# EasyEDA schematic SCH_AP-Button-LED-V2_EasyEDA.json
TITLE: Sheet_1; REV: 1.0; Date: 2024-01-07; Sheet: 1/1; Drawn By: scottguiness; Company: Your Company
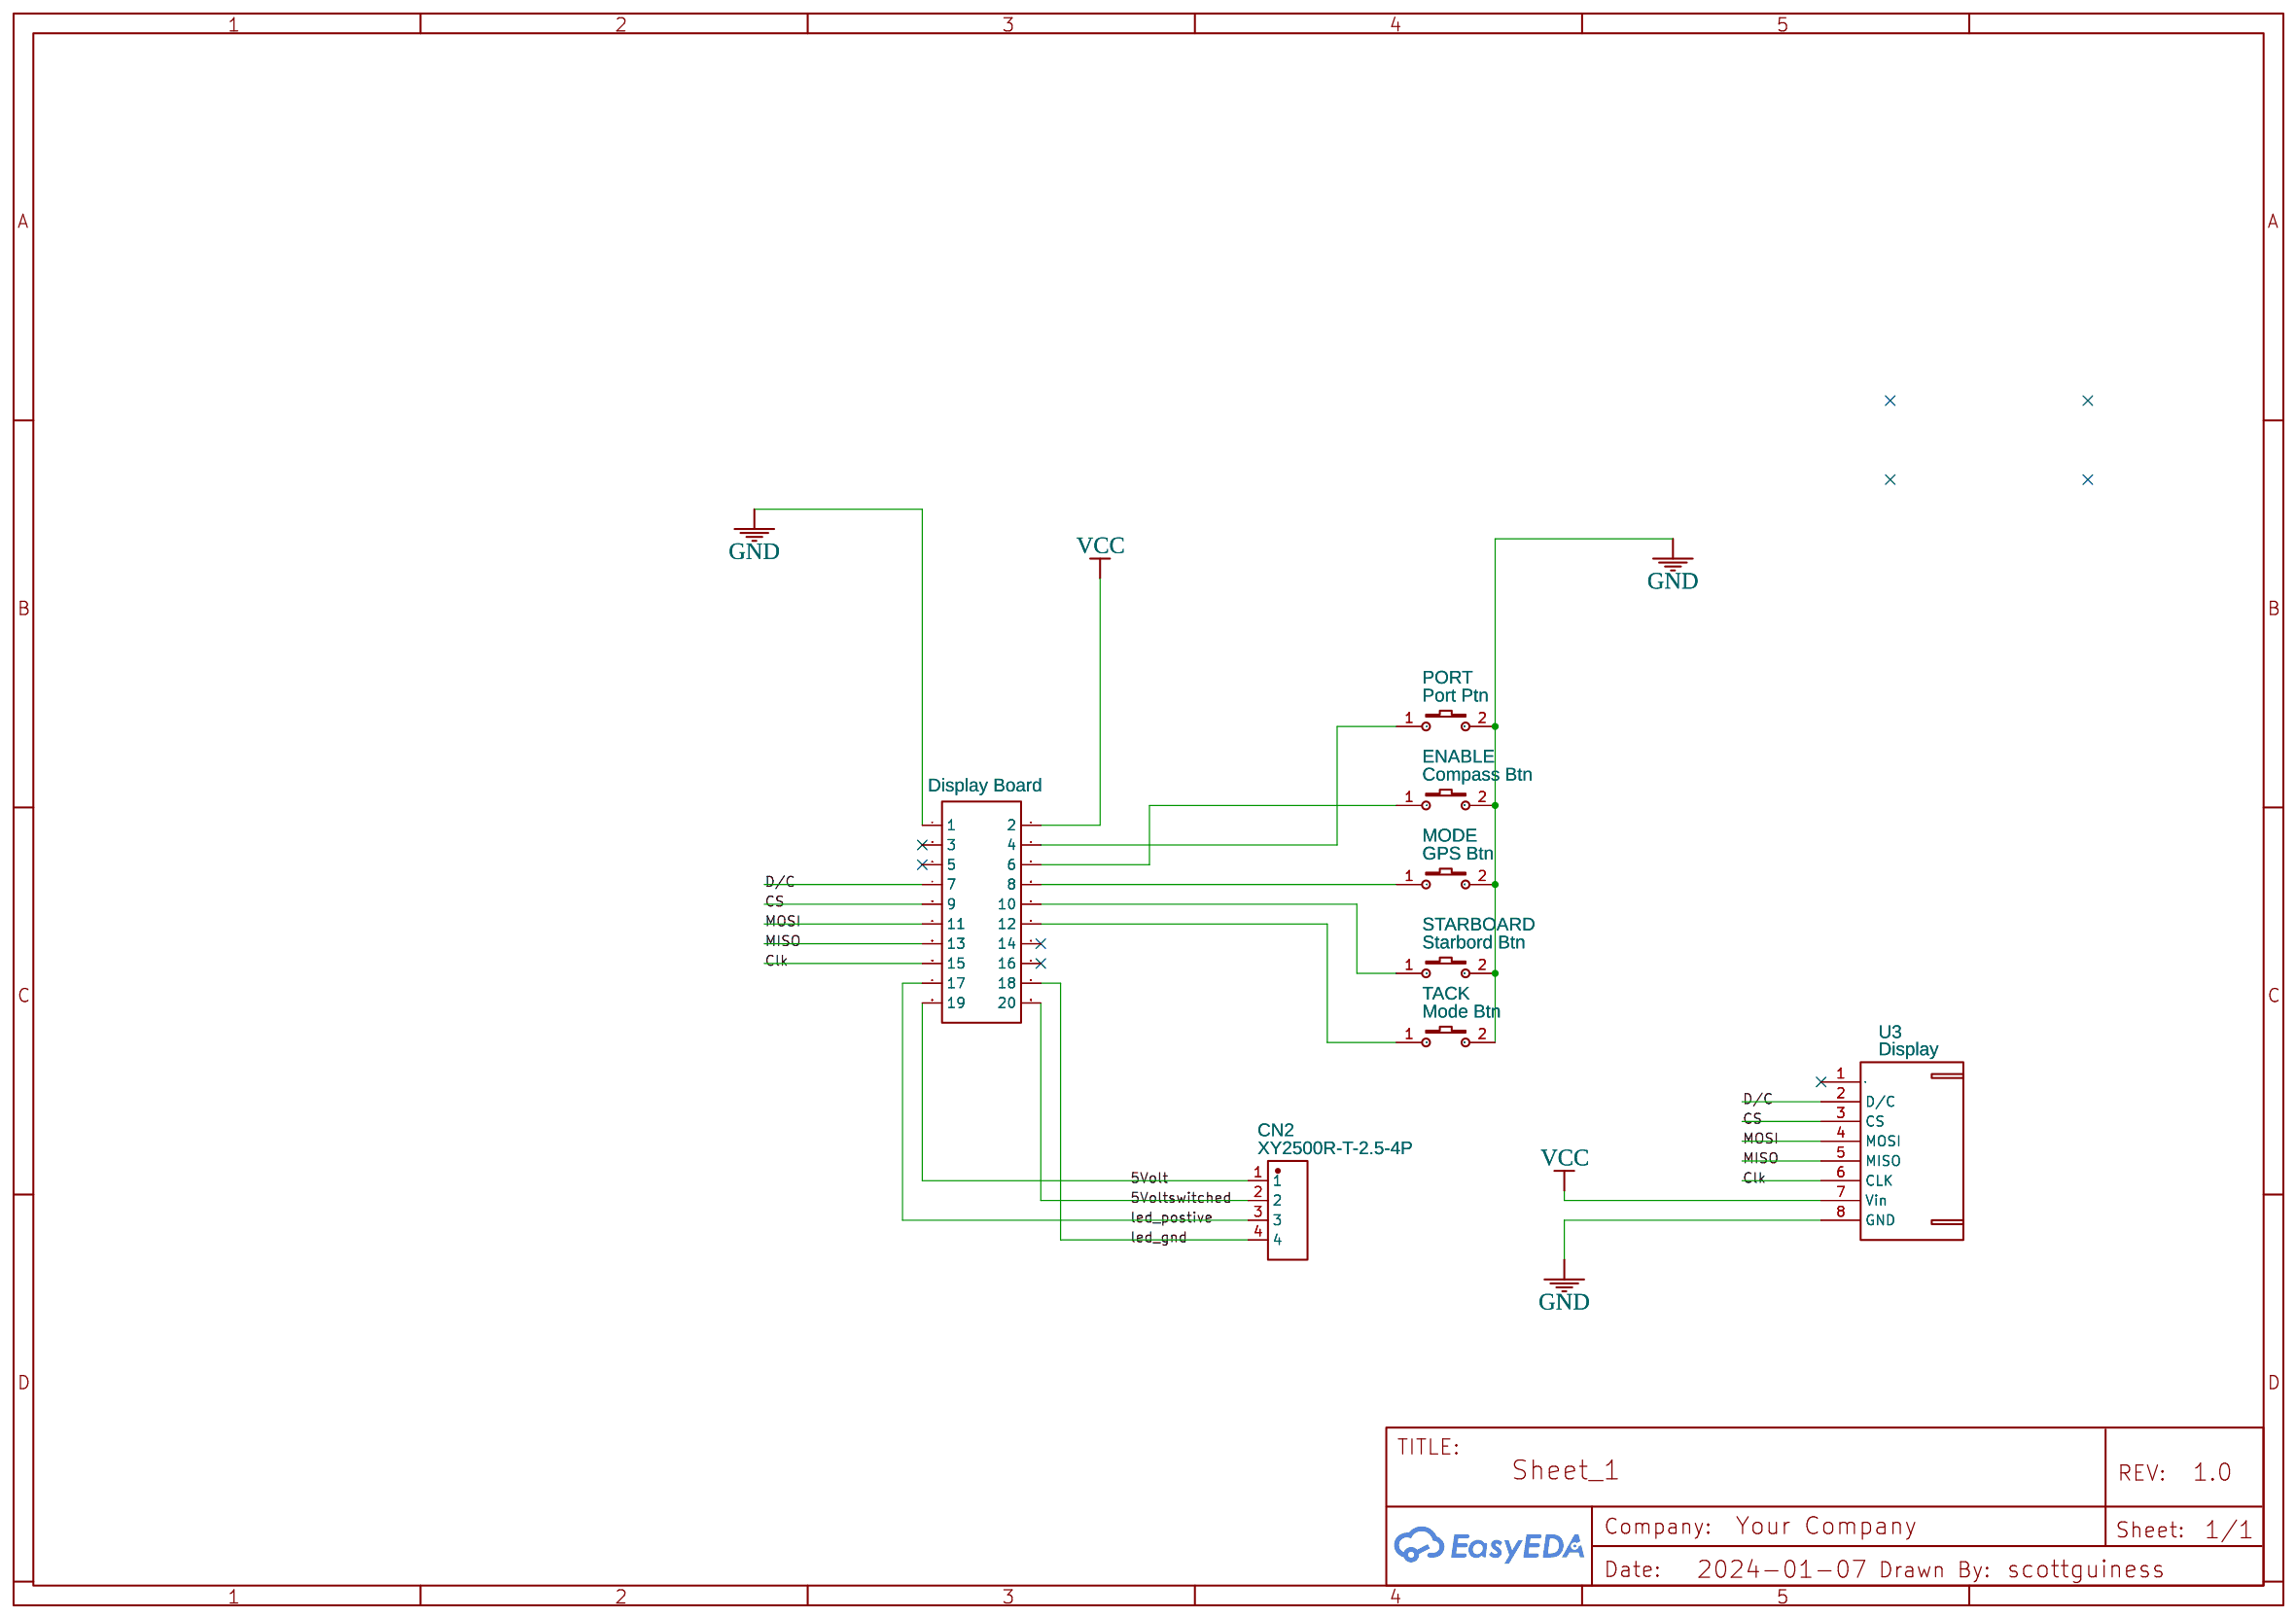
[diagram p0: schematic sheet]

## Parts
BUTTON_LED1  Display Board  [HDR-M-2.54_2X10]
CN2  XY2500R-T-2.5-4P  [CONN-TH_XY2500R-T-2.5-4P]
ENABLE  Compass Btn  [KEY-SMD_2P-L6.2-W3.6-LS8.0]
MODE  GPS Btn  [KEY-SMD_2P-L6.2-W3.6-LS8.0]
PORT  Port Ptn  [KEY-SMD_2P-L6.2-W3.6-LS8.0]
STARBOARD  Starbord Btn  [KEY-SMD_2P-L6.2-W3.6-LS8.0]
TACK  Mode Btn  [KEY-SMD_2P-L6.2-W3.6-LS8.0]
U3  Display  [JST-XH-8-PIN]

## Library data of the parts
BUTTON_LED1 = HDR-M-2.54_2x10: Supplier Part: C124359; Supplier: LCSC; Contributor: LCEDA_Lib
CN2 = XY2500R-T-2.5-4P: Contributor: LCSC; Supplier: LCSC; Supplier Part: C784963; Manufacturer: XINLAIYA(新莱亚); JLCPCB Part Class: Extended Part
ENABLE MODE PORT STARBOARD TACK = K2-3.6×6.1_SMD: Supplier Part: C118141; Supplier: LCSC; Manufacturer Part: K2-1107ST-A4SW-06; Contributor: LCEDA_Lib; 制造商: 韩国韩荣
U3 = JST-XH-8-Pin: Contributor: loyboy

## Nets
5Volt: BUTTON_LED1.19 CN2.1
5Voltswitched: BUTTON_LED1.20 CN2.2
GND: BUTTON_LED1.1 ENABLE.2 MODE.2 PORT.2 STARBOARD.2 TACK.2 U3.8(GND)
VCC: BUTTON_LED1.2 U3.7(Vin)
Clk: BUTTON_LED1.15 U3.6(CLK)
CS: BUTTON_LED1.9 U3.3(CS)
D/C: BUTTON_LED1.7 U3.2(D/C)
led_gnd: BUTTON_LED1.18 CN2.4
led_postive: BUTTON_LED1.17 CN2.3
MISO: BUTTON_LED1.13 U3.5(MISO)
MOSI: BUTTON_LED1.11 U3.4(MOSI)
Net-(BUTTON_LED1-4): BUTTON_LED1.4 PORT.1
Net-(BUTTON_LED1-6): BUTTON_LED1.6 ENABLE.1
Net-(BUTTON_LED1-8): BUTTON_LED1.8 MODE.1
Net-(BUTTON_LED1-10): BUTTON_LED1.10 STARBOARD.1
Net-(BUTTON_LED1-12): BUTTON_LED1.12 TACK.1

Not connected (* = marked no-connect by the designer): BUTTON_LED1 3* 5* 14* 16*; U3 1*
